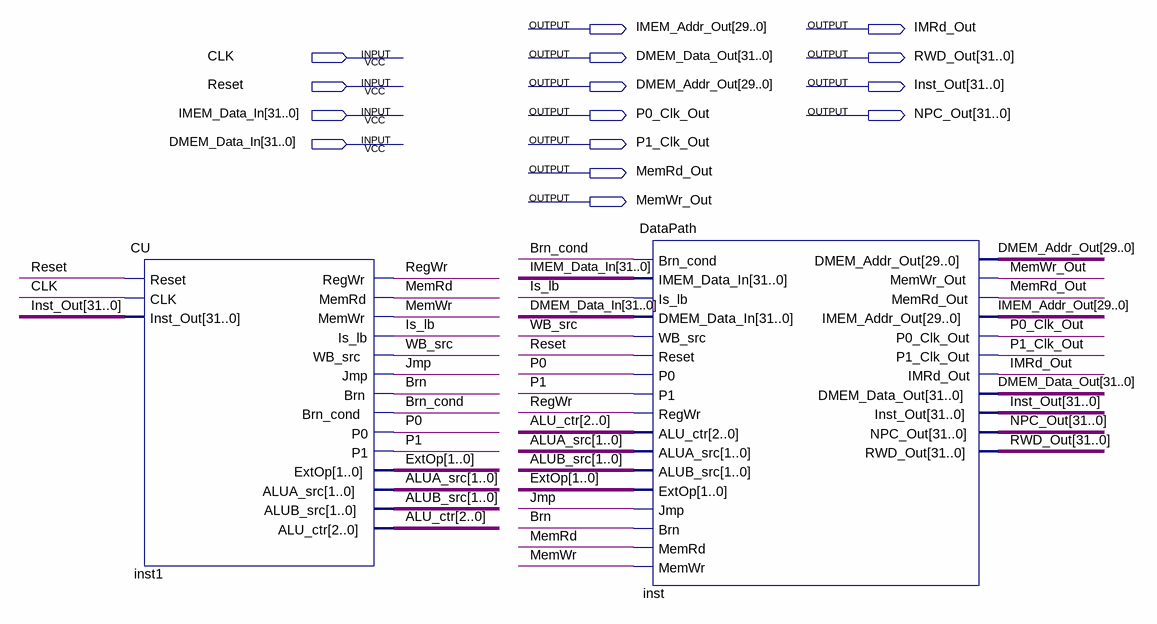
[diagram p0: schematic sheet]
// Quartus schematic CPU.bdf as structural Verilog: 2 symbols, 15 pins
module CPU (
  input  CLK,
  input  Reset,
  input  [31:0] IMEM_Data_In,
  input  [31:0] DMEM_Data_In,
  output [29:0] IMEM_Addr_Out,
  output IMRd_Out,
  output [31:0] DMEM_Data_Out,
  output [31:0] RWD_Out,
  output [29:0] DMEM_Addr_Out,
  output [31:0] Inst_Out,
  output P0_Clk_Out,
  output [31:0] NPC_Out,
  output P1_Clk_Out,
  output MemRd_Out,
  output MemWr_Out
);

  wire Brn, Brn_cond, Is_lb, Jmp, MemRd, MemWr, P0, P1, RegWr, WB_src;
  wire [1:0] ALUA_src, ALUB_src, ExtOp;
  wire [2:0] ALU_ctr;

  CU inst1 (
    .Reset(Reset), .CLK(CLK), .Inst_Out(Inst_Out), .RegWr(RegWr), .MemRd(MemRd), .MemWr(MemWr),
    .Is_lb(Is_lb), .WB_src(WB_src), .Jmp(Jmp), .Brn(Brn), .Brn_cond(Brn_cond), .P0(P0), .P1(P1),
    .ExtOp(ExtOp), .ALUA_src(ALUA_src), .ALUB_src(ALUB_src), .ALU_ctr(ALU_ctr));
  DataPath inst (
    .Brn_cond(Brn_cond), .IMEM_Data_In(IMEM_Data_In), .Is_lb(Is_lb), .DMEM_Data_In(DMEM_Data_In),
    .WB_src(WB_src), .Reset(Reset), .P0(P0), .P1(P1), .RegWr(RegWr), .ALU_ctr(ALU_ctr), .ALUA_src(ALUA_src),
    .ALUB_src(ALUB_src), .ExtOp(ExtOp), .Jmp(Jmp), .Brn(Brn), .MemRd(MemRd), .MemWr(MemWr),
    .DMEM_Addr_Out(DMEM_Addr_Out), .MemWr_Out(MemWr_Out), .MemRd_Out(MemRd_Out),
    .IMEM_Addr_Out(IMEM_Addr_Out), .P0_Clk_Out(P0_Clk_Out), .P1_Clk_Out(P1_Clk_Out), .IMRd_Out(IMRd_Out),
    .DMEM_Data_Out(DMEM_Data_Out), .Inst_Out(Inst_Out), .NPC_Out(NPC_Out), .RWD_Out(RWD_Out));
endmodule
